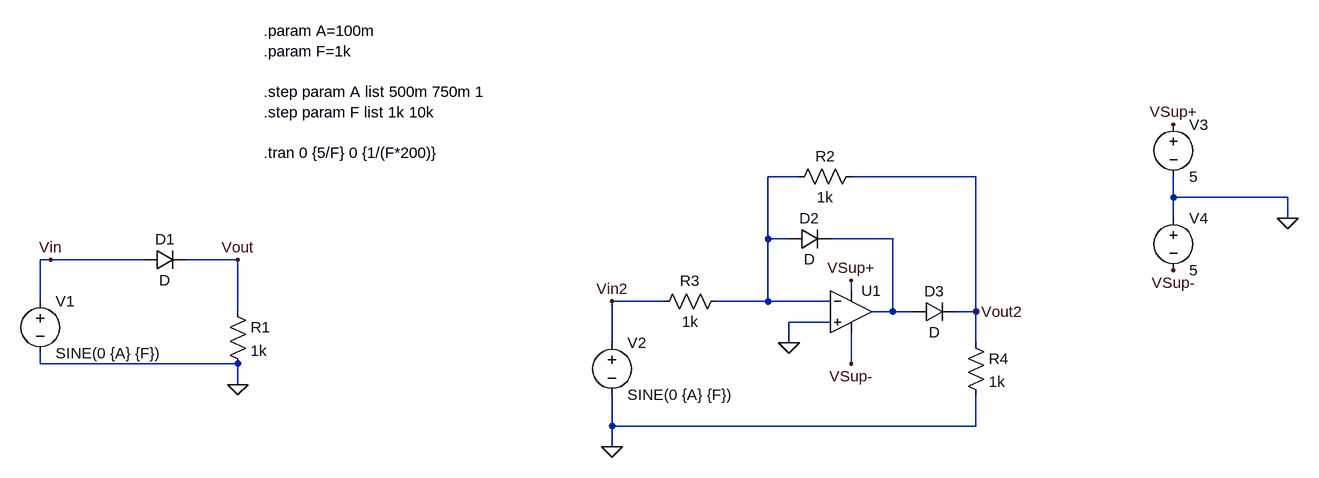
[diagram p0: schematic HalfWaveDiode.asc]
HalfWaveDiode.asc, the LTspice schematic file:
Version 4.1
SHEET 1 1892 680
WIRE 1120 -16 1072 -16
WIRE 1392 -16 1200 -16
WIRE 1696 16 1696 -16
WIRE 1872 16 1696 16
WIRE 1696 48 1696 16
WIRE 1872 48 1872 16
WIRE 1072 80 1072 -16
WIRE 1104 80 1072 80
WIRE 1264 80 1168 80
WIRE -32 112 -48 112
WIRE 112 112 -32 112
WIRE 256 112 176 112
WIRE 1200 160 1200 144
WIRE -48 176 -48 112
WIRE 912 176 832 176
WIRE 1072 176 1072 80
WIRE 1072 176 992 176
WIRE 1168 176 1072 176
WIRE 256 192 256 112
WIRE 1264 192 1264 80
WIRE 1264 192 1232 192
WIRE 1296 192 1264 192
WIRE 1392 192 1392 -16
WIRE 1392 192 1360 192
WIRE 1168 208 1104 208
WIRE 832 240 832 176
WIRE 1104 240 1104 208
WIRE 1392 240 1392 192
WIRE -48 272 -48 256
WIRE 256 272 -48 272
WIRE 1200 272 1200 224
WIRE 256 304 256 272
WIRE 832 368 832 320
WIRE 1392 368 1392 320
WIRE 1392 368 832 368
WIRE 832 400 832 368
FLAG -32 112 Vin
FLAG 256 112 Vout
FLAG 832 176 Vin2
FLAG 1392 192 Vout2
FLAG 1200 144 VSup+
FLAG 1200 272 VSup-
FLAG 1696 -96 VSup+
FLAG 1872 48 0
FLAG 1696 128 VSup-
FLAG 256 304 0
FLAG 832 400 0
FLAG 1104 240 0
SYMBOL diode 112 128 R270
WINDOW 0 32 32 VTop 2
WINDOW 3 0 32 VBottom 2
SYMATTR InstName D1
SYMBOL res 240 176 R0
SYMATTR InstName R1
SYMATTR Value 1k
SYMBOL voltage -48 160 R0
WINDOW 123 24 124 Left 2
WINDOW 39 0 0 Left 0
SYMATTR InstName V1
SYMATTR Value SINE(0 {A} {F})
SYMBOL diode 1104 96 R270
WINDOW 0 32 32 VTop 2
WINDOW 3 0 32 VBottom 2
SYMATTR InstName D2
SYMBOL diode 1296 208 R270
WINDOW 0 32 32 VTop 2
WINDOW 3 0 32 VBottom 2
SYMATTR InstName D3
SYMBOL res 1216 -32 R90
WINDOW 0 0 56 VBottom 2
WINDOW 3 32 56 VTop 2
SYMATTR InstName R2
SYMATTR Value 1k
SYMBOL res 1008 160 R90
WINDOW 0 0 56 VBottom 2
WINDOW 3 32 56 VTop 2
SYMATTR InstName R3
SYMATTR Value 1k
SYMBOL OpAmps\\UniversalOpAmp 1200 192 R0
SYMATTR InstName U1
SYMBOL voltage 832 224 R0
WINDOW 123 24 124 Left 2
WINDOW 39 0 0 Left 0
SYMATTR InstName V2
SYMATTR Value SINE(0 {A} {F})
SYMBOL voltage 1696 -112 R0
WINDOW 123 0 0 Left 0
WINDOW 39 0 0 Left 0
SYMATTR InstName V3
SYMATTR Value 5
SYMBOL voltage 1696 32 R0
WINDOW 123 0 0 Left 0
WINDOW 39 0 0 Left 0
SYMATTR InstName V4
SYMATTR Value 5
SYMBOL res 1376 224 R0
SYMATTR InstName R4
SYMATTR Value 1k
TEXT 296 -240 Left 2 !.param A=100m\n.param F=1k\n \n.step param A list 500m 750m 1\n.step param F list 1k 10k\n \n.tran 0 {5/F} 0 {1/(F*200)}

The netlist it stands for:
* HalfWaveDiode.asc
D1 Vin Vout D
R1 Vout 0 1k
V1 Vin 0 SINE(0 {A} {F})
D2 N001 N002 D
D3 N002 Vout2 D
R2 Vout2 N001 1k
R3 N001 Vin2 1k
X§U1 0 N001 VSup+ VSup- N002 level1 Avol=1Meg GBW=10Meg Vos=0 En=0 Enk=0 In=0 Ink=0 Rin=500Meg  ; pins In+ In- V+ V- OUT
V2 Vin2 0 SINE(0 {A} {F})
V3 VSup+ 0 5
V4 0 VSup- 5
R4 Vout2 0 1k
.model D D
.lib standard.dio
.param A=100m
.param F=1k
.step param A list 500m 750m 1
.step param F list 1k 10k
.tran 0 {5/F} 0 {1/(F*200)}
.lib UniversalOpAmp1.lib
.backanno
.end